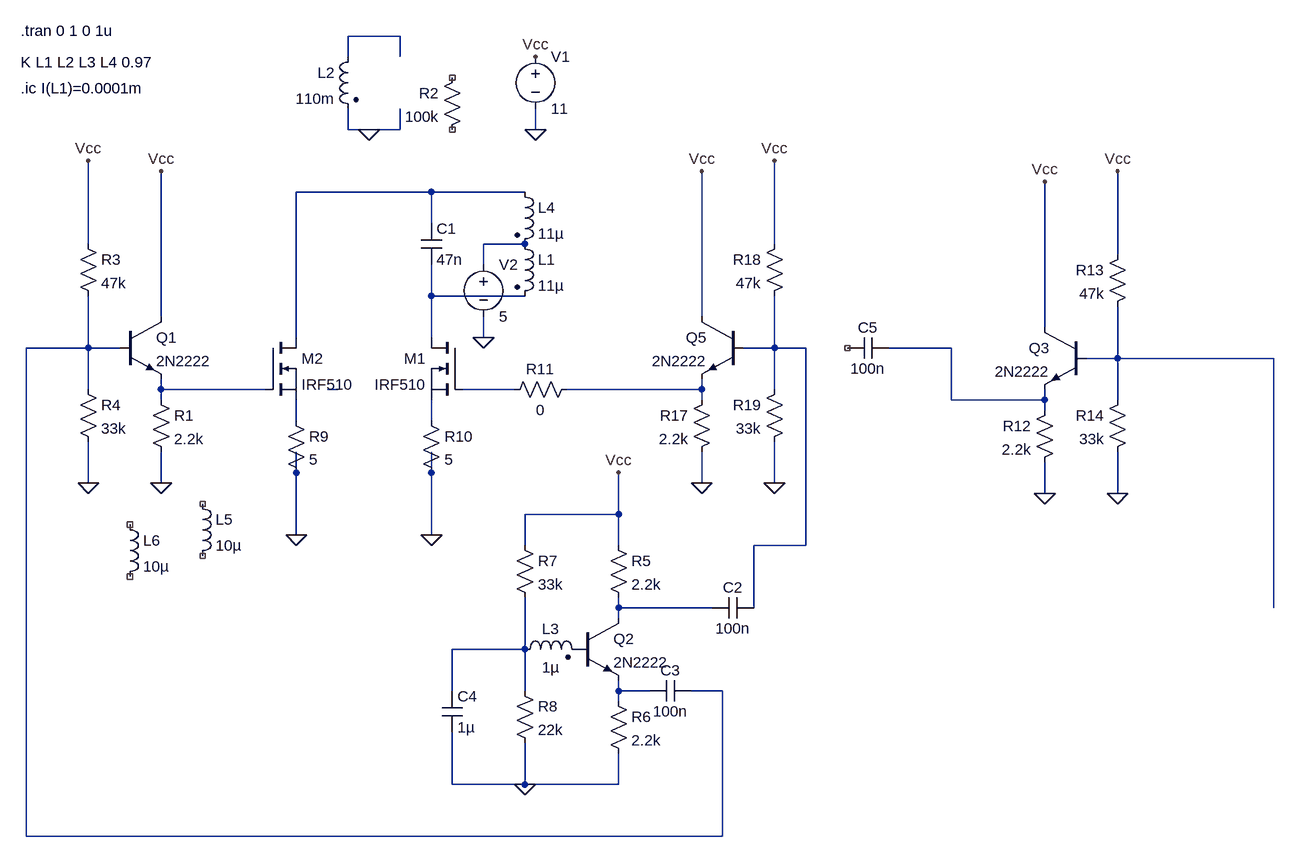
[diagram p0: schematic royer6_mosfet.asc]
royer6_mosfet.asc, the LTspice schematic file:
Version 4
SHEET 1 2216 1428
WIRE 192 16 112 16
WIRE 112 48 112 16
WIRE 192 48 192 16
WIRE 112 160 112 128
WIRE 144 160 112 160
WIRE 192 160 192 128
WIRE 192 160 144 160
WIRE 400 160 400 128
WIRE 240 256 32 256
WIRE 384 256 240 256
WIRE 240 304 240 256
WIRE -288 336 -288 208
WIRE 384 336 320 336
WIRE 768 336 768 208
WIRE 1296 352 1296 224
WIRE 320 368 320 336
WIRE 240 416 240 368
WIRE 384 416 240 416
WIRE -176 448 -176 224
WIRE 656 448 656 224
WIRE 1184 464 1184 240
WIRE 32 480 32 256
WIRE 240 480 240 416
WIRE 320 480 320 448
WIRE -288 496 -288 416
WIRE -288 496 -384 496
WIRE -240 496 -288 496
WIRE 768 496 768 416
WIRE 768 496 720 496
WIRE 816 496 768 496
WIRE 1040 496 944 496
WIRE 1296 512 1296 432
WIRE 1296 512 1248 512
WIRE 1536 512 1296 512
WIRE -288 560 -288 496
WIRE -176 560 -176 544
WIRE -16 560 -176 560
WIRE 96 560 80 560
WIRE 368 560 288 560
WIRE 656 560 656 544
WIRE 656 560 448 560
WIRE 768 560 768 496
WIRE -176 576 -176 560
WIRE 656 576 656 560
WIRE 1040 576 1040 496
WIRE 1184 576 1184 560
WIRE 1184 576 1040 576
WIRE 1296 576 1296 512
WIRE 1184 592 1184 576
WIRE 32 608 32 576
WIRE 240 608 240 576
WIRE 32 688 32 656
WIRE 240 688 240 656
WIRE -288 704 -288 640
WIRE -176 704 -176 656
WIRE 656 704 656 656
WIRE 768 704 768 640
WIRE 1184 720 1184 672
WIRE 1296 720 1296 656
WIRE 528 752 528 688
WIRE 528 752 384 752
WIRE 32 784 32 688
WIRE 240 784 240 688
WIRE 384 800 384 752
WIRE 528 800 528 752
WIRE 816 800 816 496
WIRE 816 800 736 800
WIRE 528 896 528 880
WIRE 672 896 528 896
WIRE 736 896 736 800
WIRE 1536 896 1536 512
WIRE 528 912 528 896
WIRE 384 960 384 880
WIRE 384 960 272 960
WIRE 272 1024 272 960
WIRE 384 1024 384 960
WIRE 528 1024 528 1008
WIRE 576 1024 528 1024
WIRE 688 1024 640 1024
WIRE 528 1040 528 1024
WIRE 272 1168 272 1088
WIRE 384 1168 384 1104
WIRE 384 1168 272 1168
WIRE 528 1168 528 1120
WIRE 528 1168 384 1168
WIRE -384 1248 -384 496
WIRE 688 1248 688 1024
WIRE 688 1248 -384 1248
FLAG 400 160 0
FLAG 400 48 Vcc
FLAG 144 160 0
FLAG 384 1168 0
FLAG 528 688 Vcc
FLAG 240 784 0
FLAG 656 224 Vcc
FLAG 656 704 0
FLAG 768 704 0
FLAG 768 208 Vcc
FLAG -176 224 Vcc
FLAG -176 704 0
FLAG -288 704 0
FLAG -288 208 Vcc
FLAG 32 784 0
FLAG 320 480 0
FLAG 1184 240 Vcc
FLAG 1184 720 0
FLAG 1296 720 0
FLAG 1296 224 Vcc
SYMBOL voltage 400 32 R0
WINDOW 123 0 0 Left 0
WINDOW 39 0 0 Left 0
SYMATTR InstName V1
SYMATTR Value 11
SYMBOL ind2 368 320 R0
SYMATTR InstName L1
SYMATTR Value 11µ
SYMATTR Type ind
SYMBOL ind2 128 32 M0
SYMATTR InstName L2
SYMATTR Value 110m
SYMATTR Type ind
SYMBOL ind2 368 976 R270
WINDOW 0 32 56 VTop 2
WINDOW 3 4 56 VBottom 2
SYMATTR InstName L3
SYMATTR Value 1µ
SYMATTR Type ind
SYMATTR SpiceLine Rser=0.1
SYMBOL ind2 368 240 R0
SYMATTR InstName L4
SYMATTR Value 11µ
SYMATTR Type ind
SYMBOL cap 224 304 R0
SYMATTR InstName C1
SYMATTR Value 47n
SYMBOL res 288 64 M0
SYMATTR InstName R2
SYMATTR Value 100k
SYMBOL npn 464 912 R0
SYMATTR InstName Q2
SYMATTR Value 2N2222
SYMBOL res 512 784 R0
SYMATTR InstName R5
SYMATTR Value 2.2k
SYMBOL res 512 1024 R0
SYMATTR InstName R6
SYMATTR Value 2.2k
SYMBOL res 368 784 R0
SYMATTR InstName R7
SYMATTR Value 33k
SYMBOL res 368 1008 R0
SYMATTR InstName R8
SYMATTR Value 22k
SYMBOL cap 256 1024 R0
SYMATTR InstName C4
SYMATTR Value 1µ
SYMBOL cap 736 880 R90
WINDOW 0 0 32 VBottom 2
WINDOW 3 32 32 VTop 2
SYMATTR InstName C2
SYMATTR Value 100n
SYMBOL cap 640 1008 R90
WINDOW 0 0 32 VBottom 2
WINDOW 3 32 32 VTop 2
SYMATTR InstName C3
SYMATTR Value 100n
SYMBOL npn 720 448 M0
SYMATTR InstName Q5
SYMATTR Value 2N2222
SYMBOL res 672 560 M0
SYMATTR InstName R17
SYMATTR Value 2.2k
SYMBOL res 784 320 M0
SYMATTR InstName R18
SYMATTR Value 47k
SYMBOL res 784 544 M0
SYMATTR InstName R19
SYMATTR Value 33k
SYMBOL nmos 288 480 M0
SYMATTR InstName M1
SYMATTR Value IRF510
SYMBOL nmos -16 480 R0
SYMATTR InstName M2
SYMATTR Value IRF510
SYMBOL npn -240 448 R0
SYMATTR InstName Q1
SYMATTR Value 2N2222
SYMBOL res -192 560 R0
SYMATTR InstName R1
SYMATTR Value 2.2k
SYMBOL res -304 320 R0
SYMATTR InstName R3
SYMATTR Value 47k
SYMBOL res -304 544 R0
SYMATTR InstName R4
SYMATTR Value 33k
SYMBOL ind -128 720 R0
SYMATTR InstName L5
SYMATTR Value 10µ
SYMBOL res 16 592 R0
SYMATTR InstName R9
SYMATTR Value 5
SYMBOL res 224 592 R0
SYMATTR InstName R10
SYMATTR Value 5
SYMBOL ind -240 752 R0
SYMATTR InstName L6
SYMATTR Value 10µ
SYMBOL res 464 544 R90
WINDOW 0 0 56 VBottom 2
WINDOW 3 32 56 VTop 2
SYMATTR InstName R11
SYMATTR Value 0
SYMBOL voltage 320 352 R0
WINDOW 123 0 0 Left 0
WINDOW 39 0 0 Left 0
SYMATTR InstName V2
SYMATTR Value 5
SYMBOL npn 1248 464 M0
SYMATTR InstName Q3
SYMATTR Value 2N2222
SYMBOL res 1200 576 M0
SYMATTR InstName R12
SYMATTR Value 2.2k
SYMBOL res 1312 336 M0
SYMATTR InstName R13
SYMATTR Value 47k
SYMBOL res 1312 560 M0
SYMATTR InstName R14
SYMATTR Value 33k
SYMBOL cap 944 480 R90
WINDOW 0 0 32 VBottom 2
WINDOW 3 32 32 VTop 2
SYMATTR InstName C5
SYMATTR Value 100n
TEXT -392 56 Left 2 !K L1 L2 L3 L4 0.97
TEXT -392 8 Left 2 !.tran 0 1 0 1u
TEXT -392 96 Left 2 !.ic I(L1)=0.0001m

The netlist it stands for:
* royer6_mosfet.asc
V1 Vcc 0 11
L1 N003 N004 11µ
L2 N001 0 110m
L3 N016 P001 1µ Rser=0.1
L4 N002 N003 11µ
C1 N002 N004 47n
R2 NC_01 NC_02 100k
Q2 N015 P001 N017 0 2N2222
R5 Vcc N015 2.2k
R6 N017 0 2.2k
R7 Vcc N016 33k
R8 N016 0 22k
C4 N016 0 1µ
C2 N006 N015 100n
C3 N005 N017 100n
Q5 Vcc N006 N012 0 2N2222
R17 N012 0 2.2k
R18 Vcc N006 47k
R19 N006 0 33k
M1 N004 N011 N014 N014 IRF510
M2 N002 N009 N013 N013 IRF510
Q1 Vcc N005 N009 0 2N2222
R1 N009 0 2.2k
R3 Vcc N005 47k
R4 N005 0 33k
L5 NC_03 NC_04 10µ
R9 N013 0 5
R10 N014 0 5
L6 NC_05 NC_06 10µ
R11 N012 N011 0
V2 N003 0 5
Q3 Vcc N008 N007 0 2N2222
R12 N007 0 2.2k
R13 Vcc N008 47k
R14 N008 0 33k
C5 N007 NC_07 100n
.model NPN NPN
.model PNP PNP
.lib standard.bjt
.model NMOS NMOS
.model PMOS PMOS
.lib standard.mos
K L1 L2 L3 L4 0.97
.tran 0 1 0 1u
.ic I(L1)=0.0001m
.backanno
.end